# Altium schematic sheet OBC_Top.SchDoc: Top
size A4; SheetNumber: 4; SheetTotal: 10
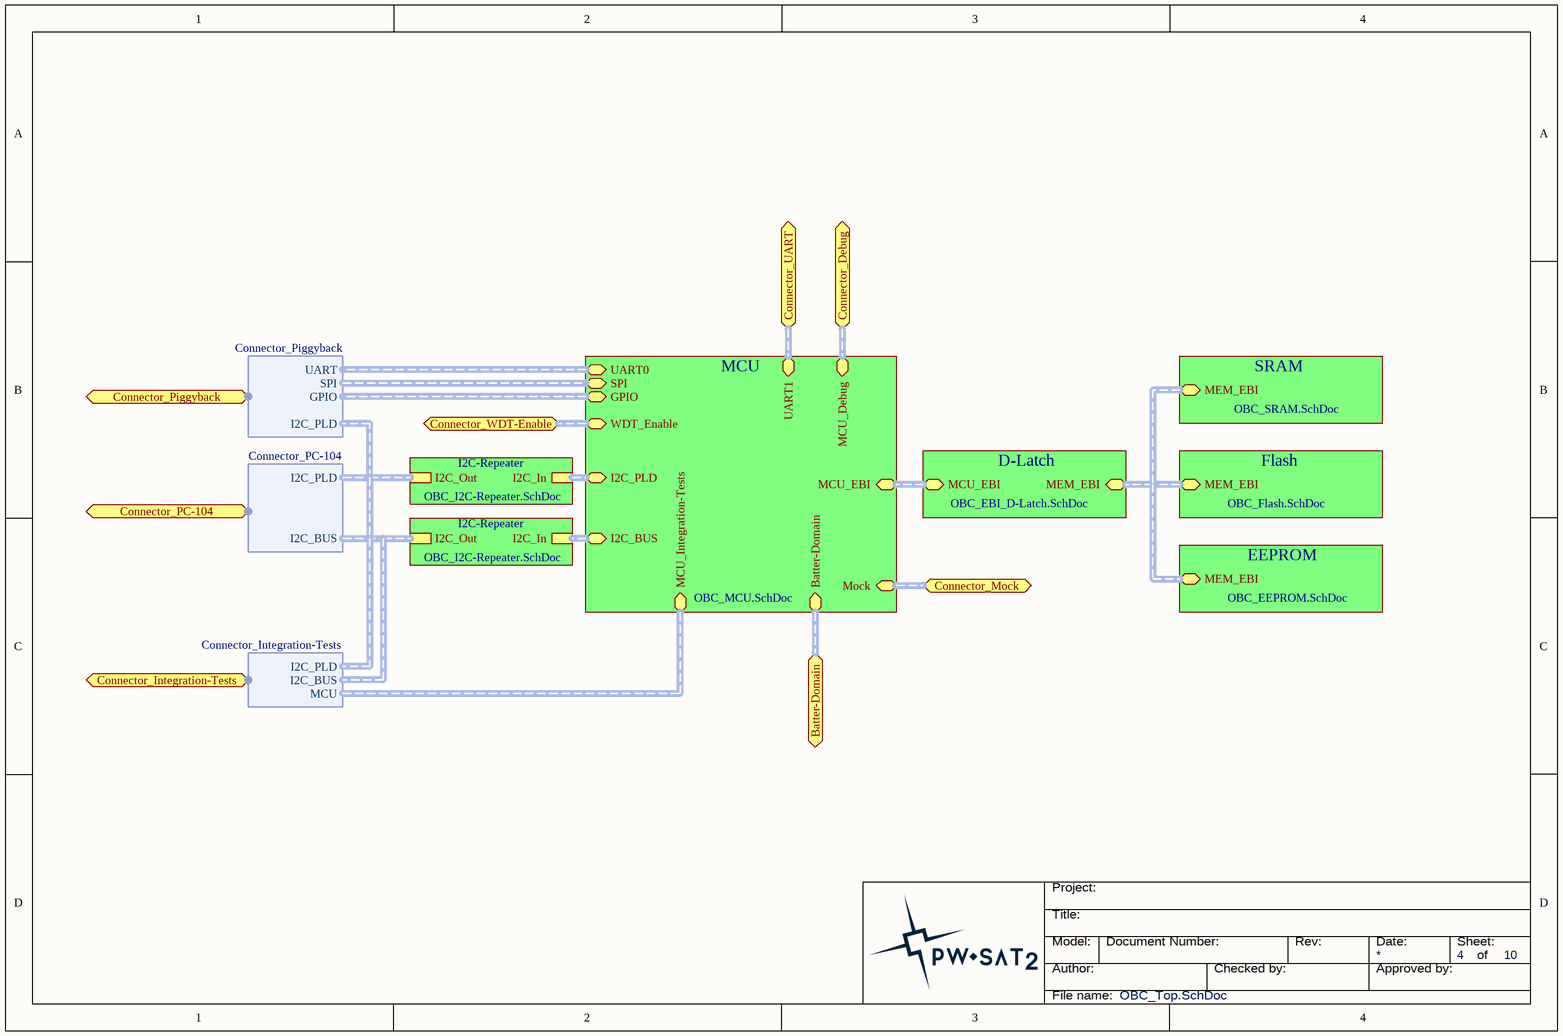
[diagram p0: OBC_Top.SchDoc]

## Sub-sheets
D-Latch = OBC_EBI_D-Latch.SchDoc: MEM_EBI (harness MEM_EBI), MCU_EBI (harness MCU_EBI)
EEPROM = OBC_EEPROM.SchDoc: MEM_EBI (harness MEM_EBI)
Flash = OBC_Flash.SchDoc: MEM_EBI (harness MEM_EBI)
I2C-Repeater = OBC_I2C-Repeater.SchDoc: I2C_Out (harness I2C), I2C_In (harness I2C)
I2C-Repeater = OBC_I2C-Repeater.SchDoc: I2C_Out (harness I2C), I2C_In (harness I2C)
MCU = OBC_MCU.SchDoc: I2C_BUS (harness I2C), I2C_PLD (harness I2C), UART0 (harness UART), SPI (harness SPI), UART1 (harness UART), GPIO (harness GPIO), Mock (harness Mock), MCU_Debug (harness MCU_Debug), MCU_EBI (harness MCU_EBI), MCU_Integration-Tests (harness MCU_Integration-Tests), WDT_Enable (harness WDT_Enable), Batter-Domain (harness Batter-Domain)
SRAM = OBC_SRAM.SchDoc: MEM_EBI (harness MEM_EBI)

## Ports
Batter-Domain (harness Batter-Domain), Connector_Debug (harness MCU_Debug), Connector_Integration-Tests (harness Connector_Integration-Tests), Connector_Mock (harness Mock), Connector_PC-104 (harness Connector_PC-104), Connector_Piggyback (harness Connector_Piggyback), Connector_UART (harness UART), Connector_WDT-Enable (harness WDT_Enable)

## Harnesses
Connector_Piggyback: UART, SPI, I2C_PLD, GPIO
Connector_PC-104: I2C_BUS, I2C_PLD
Connector_Integration-Tests: MCU, I2C_PLD, I2C_BUS

## Buses and harness runs
harness port Batter-Domain = sheet MCU/Batter-Domain
harness port Connector_Debug = sheet MCU/MCU_Debug
harness port Connector_Mock = sheet MCU/Mock
harness port Connector_UART = sheet MCU/UART1
harness port Connector_WDT-Enable = sheet MCU/WDT_Enable
harness sheet D-Latch/MCU_EBI = sheet MCU/MCU_EBI
harness sheet D-Latch/MEM_EBI = sheet EEPROM/MEM_EBI = sheet Flash/MEM_EBI = sheet SRAM/MEM_EBI
harness sheet I2C-Repeater/I2C_In = sheet MCU/I2C_BUS
harness sheet I2C-Repeater/I2C_In = sheet MCU/I2C_PLD

## Notes on the sheet
- Title:
- Project:
- Author:
- Model:
- Document Number:
- Checked by:
- Rev:
- Date:
- Approved by:
- Sheet:
- of
- File name: